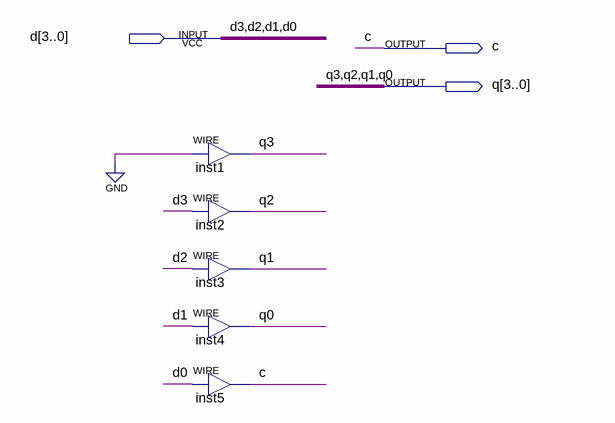
[diagram p0: schematic sheet]
// Quartus schematic s26_lsr.bdf as structural Verilog: 5 symbols, 3 pins
module s26_lsr (
  input  [3:0] d,
  output c,
  output [3:0] q
);

  assign q[3] = 1'b0;  // WIRE inst1
  assign q[2] = d[3];  // WIRE inst2
  assign q[1] = d[2];  // WIRE inst3
  assign q[0] = d[1];  // WIRE inst4
  assign c = d[0];  // WIRE inst5
endmodule
